# EAGLE schematic usbctest (EAGLE 9.6.2)
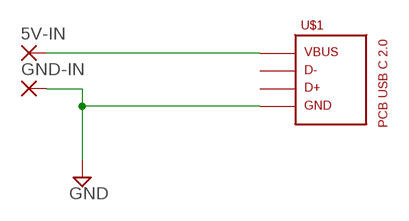
[diagram p0: schematic, sheet 1]

## Parts
5V-IN  2,54/0,9  [2,54/0,9]
GND-IN  2,54/0,9  [2,54/0,9]
U$1  PCB_USB_C_2.0W_2  [USB_TYPE_C_W_2.0_2]

## Nets
5VIN [power]: 5V-IN.1(P) U$1.VBUS
GND [power]: GND-IN.1(P) U$1.GND
Unconnected: U$1.D+ U$1.D-

## Library data of the parts
5V-IN GND-IN = wirepad:2,54/0,9: THROUGH-HOLE PAD
U$1 = USB_pcb_connectors:PCB_USB_C_2.0

## Net classes
1 power: width 0.381 mm